# Altium schematic sheet 02_FPGA_IO_Config.SchDoc: Наименование
size 420 x 297 mm; Name: Наименование; ApprovedBy: Сергеева А.А.; CheckedBy: Рогозин А.А.; Author: Кузнецов М.Д.; CompanyName: МГТУ им. Баумана; DocumentNumber: 3; SheetNumber: 2; SheetTotal: 6; PageSetup: Record=PageOptions|CenterHorizontal=True|CenterVertical=True|PrintScale=0.94|XCorrection=1.00|YCorrection=1.00|PrintKind=1|BorderSize=5000000|LeftOffset=0|BottomOffset=0|Orientation=1|PaperLength=1000|PaperWidth=1000|Scale=100|PaperSource=7|PrintQuality=-4|MediaType=1|DitherType=10|PaperKind=A4|PrintScaleMode=1; DecimalNumber: МГТУ.468784.001; HeadOfSector: Нач. сектора; MainDevice: Перв.примен.; Name1: Плата расширения; n_kontr: Н. Контр; t_kontr: Т. Контр; lit_A: О; Name2: для отладочного модуля; DocumentName: Sheet1.SCHDOC
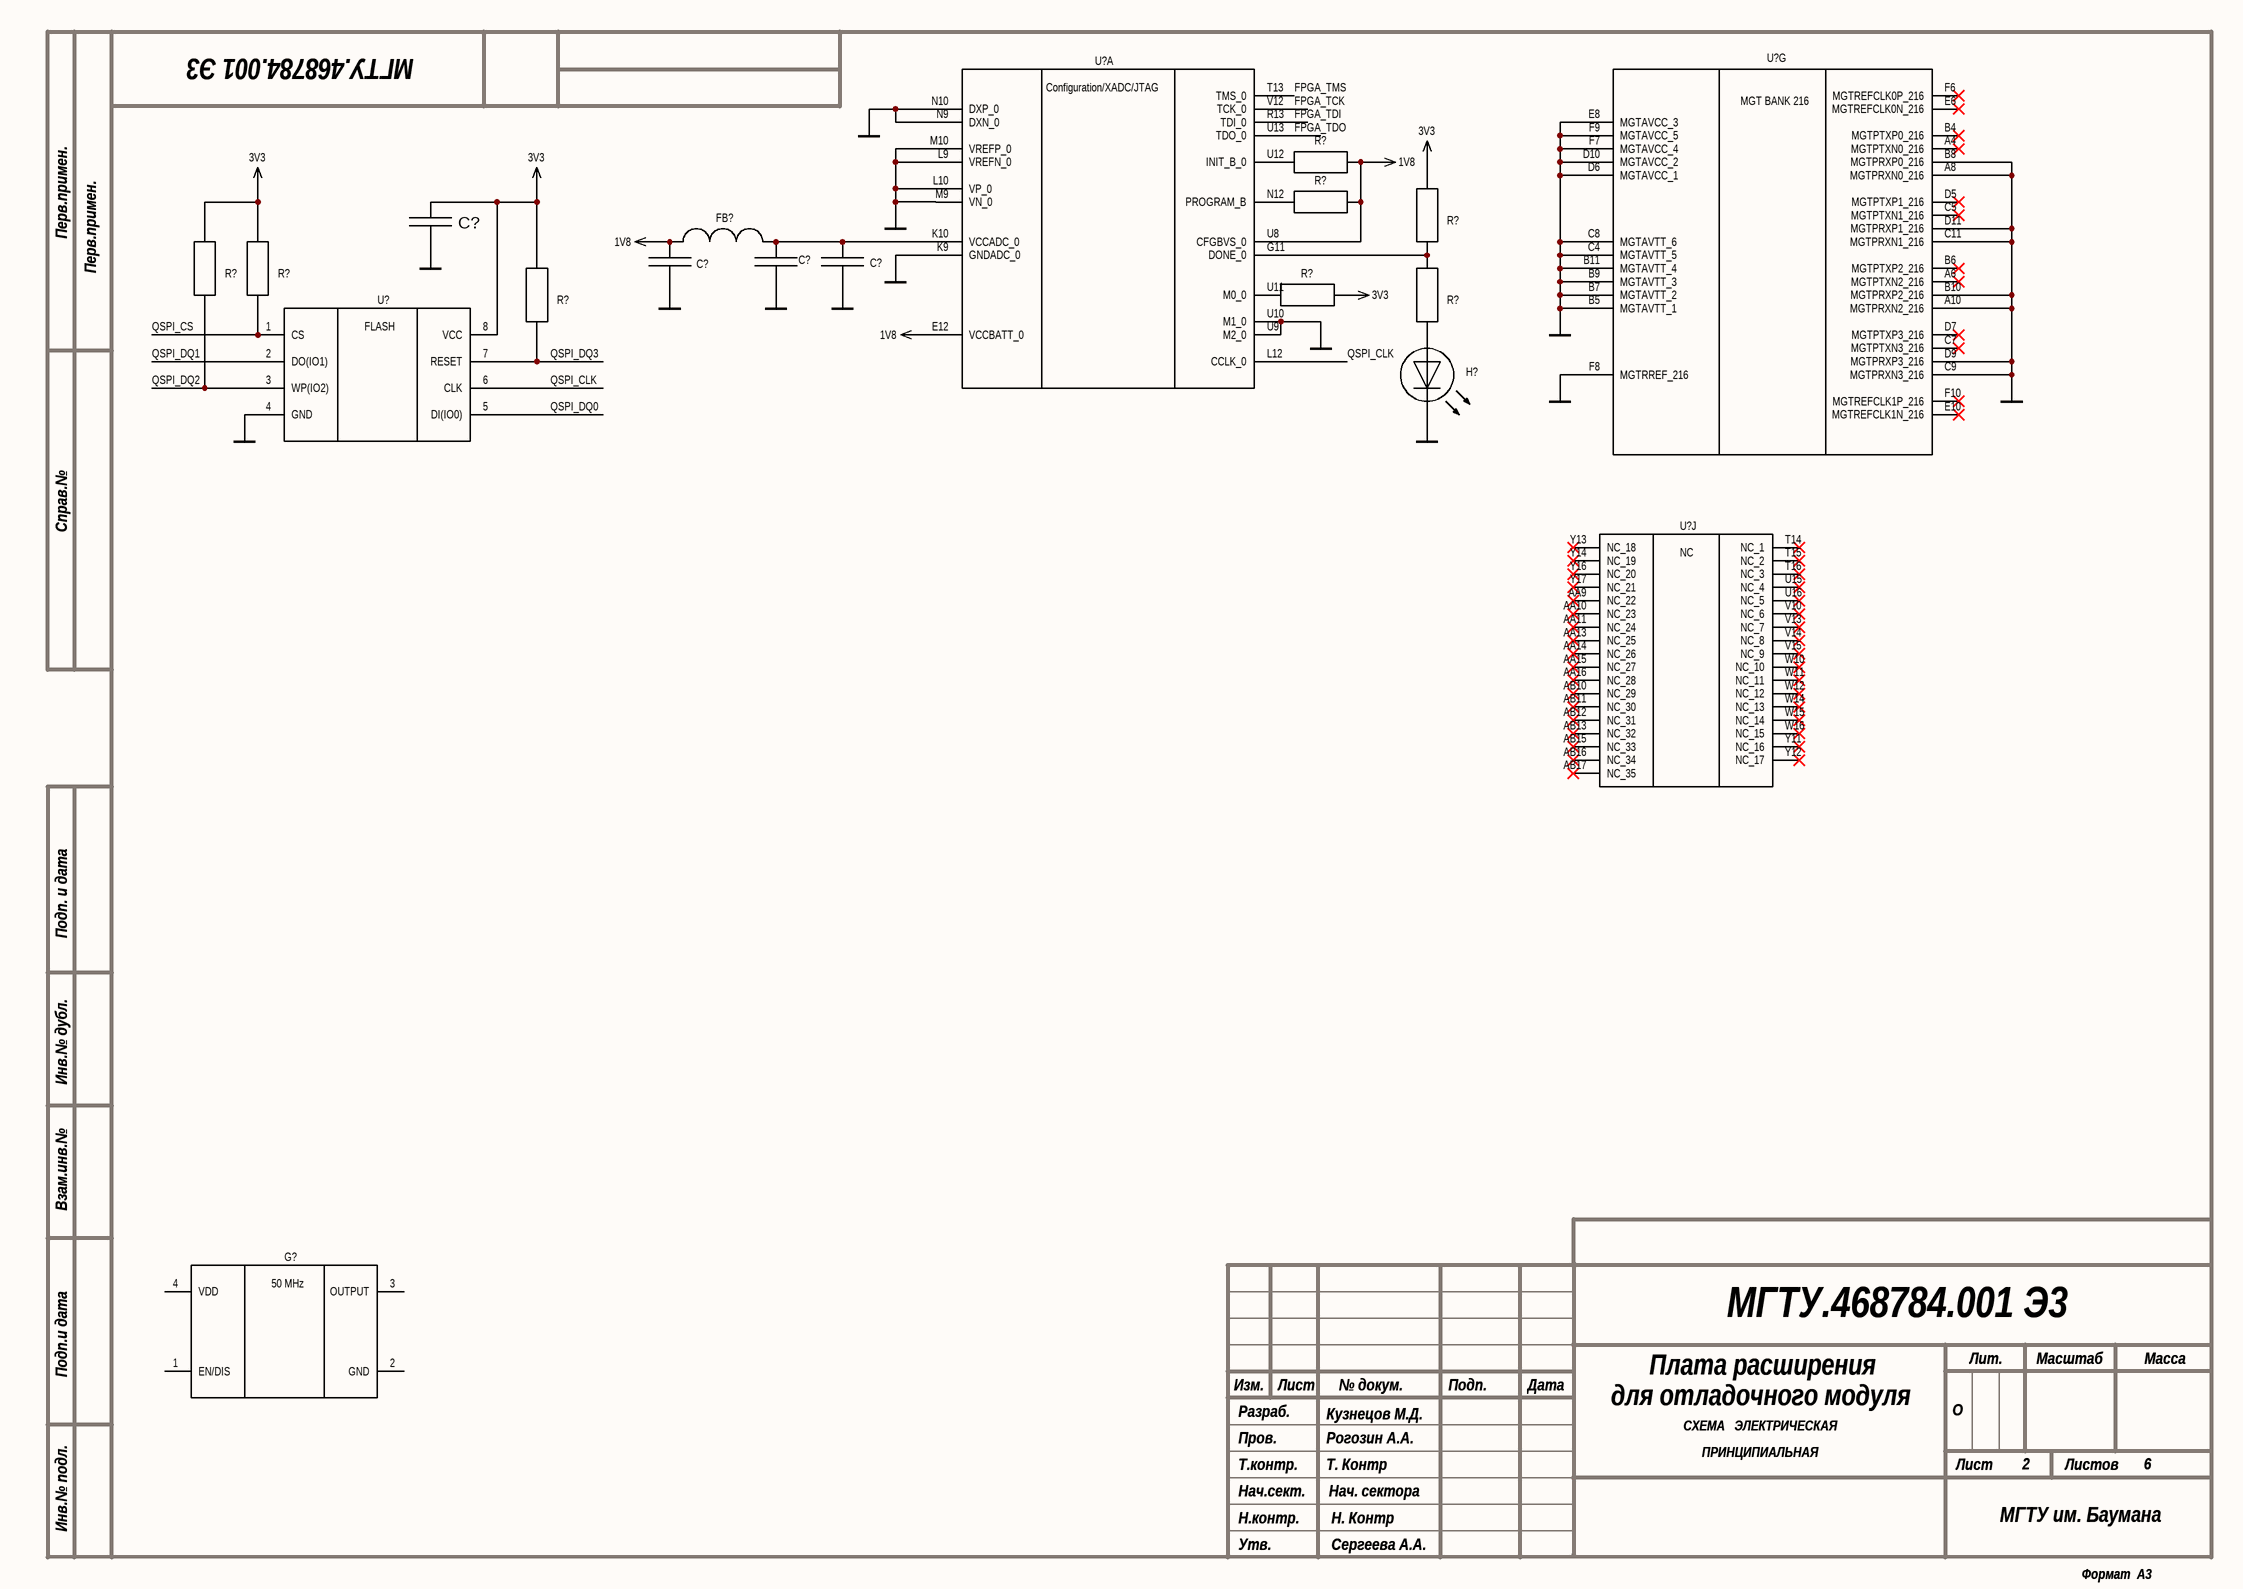
[diagram p0: 02_FPGA_IO_Config.SchDoc]

## Parts
(Parts that share a designator on the sheet are numbered #1, #2 ... from top to bottom, then left to right.)
C?#1  C  [C_0603]  (value not drawn)
C?#2  C  [C_1206]  (value not drawn)
C?#3  C  [C_0805]  (value not drawn)
C?#4  C  [C_0603]  (value not drawn)
FB?  BLM18SG121TN1D  [FP-BLM18-0_15-t0_5-d1_2-IPC_B]  (value not drawn)
G?  ASV-50.000MHZ-LRS-T  [ASV25000MHZEJT]  (value not drawn)
H?  LED  [PLCC2]  (value not drawn)
R?#1  R  [R_1206]  (value not drawn)
R?#2  R  [R_1206]  (value not drawn)
R?#3  R  [R_1206]  (value not drawn)
R?#4  R  [R_1206]  (value not drawn)
R?#5  R  [R_1206]  (value not drawn)
R?#6  R  [R_0603]  (value not drawn)
R?#7  R  [R_0603]  (value not drawn)
R?#8  R  [R_0603]  (value not drawn)
U?#1  XC7A50T-2FGG484I  [BGA484C100P22X22_2300X2300X260]  (value not drawn)  (part A of 10)
U?#2  XC7A50T-2FGG484I  [BGA484C100P22X22_2300X2300X260]  (value not drawn)  (part G of 10)
U?#3  W25Q128JVSIQ  [SOIC127P790X216-8N]  (value not drawn)
U?#4  XC7A50T-2FGG484I  [BGA484C100P22X22_2300X2300X260]  (value not drawn)  (part J of 10)

## Nets
1V8: C?#3.2 FB?.1 R?#1.2 R?#2.2 U?#1.E12(VCCBATT_0) U?#1.U8(CFGBVS_0)
3V3: C?#1.2 R?#3.1 R?#4.1 R?#5.1 R?#6.2 R?#7.2 U?#3.8(VCC)
GND: C?#1.1 C?#2.2 C?#3.1 C?#4.1 H?.2(C) U?#1.K9(GNDADC_0) U?#1.L9(VREFN_0) U?#1.L10(VP_0) U?#1.M9(VN_0) U?#1.M10(VREFP_0) U?#1.N9(DXN_0) U?#1.N10(DXP_0) U?#1.U9(M2_0) U?#1.U10(M1_0) U?#2.A8(MGTPRXN0_216) U?#2.A10(MGTPRXN2_216) U?#2.B5(MGTAVTT_1) U?#2.B7(MGTAVTT_2) U?#2.B8(MGTPRXP0_216) U?#2.B9(MGTAVTT_3) U?#2.B10(MGTPRXP2_216) U?#2.B11(MGTAVTT_4) U?#2.C4(MGTAVTT_5) U?#2.C8(MGTAVTT_6) U?#2.C9(MGTPRXN3_216) U?#2.C11(MGTPRXN1_216) U?#2.D6(MGTAVCC_1) U?#2.D9(MGTPRXP3_216) U?#2.D10(MGTAVCC_2) U?#2.D11(MGTPRXP1_216) U?#2.E8(MGTAVCC_3) U?#2.F7(MGTAVCC_4) U?#2.F8(MGTRREF_216) U?#2.F9(MGTAVCC_5) U?#3.4(GND)
FPGA_TCK: U?#1.V12(TCK_0)
FPGA_TDI: U?#1.R13(TDI_0)
FPGA_TDO: U?#1.U13(TDO_0)
FPGA_TMS: U?#1.T13(TMS_0)
QSPI_CLK: U?#1.L12(CCLK_0) U?#3.6(CLK)
QSPI_CS: R?#4.2 U?#3.1(CS)
QSPI_DQ0: U?#3.5(DI(IO0))
QSPI_DQ1: U?#3.2(DO(IO1))
QSPI_DQ2: R?#3.2 U?#3.3(WP(IO2))
QSPI_DQ3: R?#5.2 U?#3.7(RESET)
NetC?#2_1: C?#2.1 C?#4.2 FB?.2 U?#1.K10(VCCADC_0)
NetH?_1: H?.1(A) R?#8.1
NetR?#1_1: R?#1.1 U?#1.U12(INIT_B_0)
NetR?#2_1: R?#2.1 U?#1.N12(PROGRAM_B)
NetR?#6_1: R?#6.1 R?#8.2 U?#1.G11(DONE_0)
NetR?#7_1: R?#7.1 U?#1.U11(M0_0)

Not connected (* = marked no-connect by the designer): G? 1(EN/DIS) 2(GND) 3(OUTPUT) 4(VDD); U?#2 A4(MGTPTXN0_216)* A6(MGTPTXN2_216)* B4(MGTPTXP0_216)* B6(MGTPTXP2_216)* C5(MGTPTXN1_216)* C7(MGTPTXN3_216)* D5(MGTPTXP1_216)* D7(MGTPTXP3_216)* E6(MGTREFCLK0N_216)* E10(MGTREFCLK1N_216)* F6(MGTREFCLK0P_216)* F10(MGTREFCLK1P_216)*; U?#4 AA9(NC_22)* AA10(NC_23)* AA11(NC_24)* AA13(NC_25)* AA14(NC_26)* AA15(NC_27)* AA16(NC_28)* AB10(NC_29)* AB11(NC_30)* AB12(NC_31)* AB13(NC_32)* AB15(NC_33)* AB16(NC_34)* AB17(NC_35)* T14(NC_1)* T15(NC_2)* T16(NC_3)* U15(NC_4)* U16(NC_5)* V10(NC_6)* V13(NC_7)* V14(NC_8)* V15(NC_9)* W10(NC_10)* W11(NC_11)* W12(NC_12)* W14(NC_13)* W15(NC_14)* W16(NC_15)* Y11(NC_16)* Y12(NC_17)* Y13(NC_18)* Y14(NC_19)* Y16(NC_20)* Y17(NC_21)*

## Notes on the sheet
- Перв.примен.
- Справ.№
- Подп. и дата
- Инв.№ дубл.
- Взам.инв.№
- Подп.и дата
- Разраб.
- Изм.
- Лист
- № докум.
- Подп.
- Дата
- Лит.
- Масштаб
- Масса
- Т.контр.
- Пров.
- СХЕМА   ЭЛЕКТРИЧЕСКАЯ
- ПРИНЦИПИАЛЬНАЯ
- Листов
- Инв.№ подл.
- Утв.
- Н.контр.
- Нач.сект.
- Формат  A3
- (in symbol ASV-50.000MHZ-LRS-T) 50 MHz
- (in symbol W25Q128JVSIQ) FLASH
- (in symbol XC7A50T-2FGG484I, part A) Configuration/XADC/JTAG
- (in symbol XC7A50T-2FGG484I, part G) MGT BANK 216
- (in symbol XC7A50T-2FGG484I, part J) NC

## Library data of the parts
C?#1 C?#4 = Конденсатор GRM188R71C104K (0.10 мкФ +-10% X7R 16В): Capacitance: 0u1; Tolerance: ±10%; Dielectric Type: X7R; Maximum Voltage: 16V; Part Number: Конденсатор GRM188R71C104K (0.10 мкФ +-10% X7R 16В); HelpURL: http://search.murata.co.jp/Ceramy/image/img/A01X/G101/ENG/GRM188R71C104KA01-01.pdf
C?#2 = Конденсатор GRM31CR71H475K (4.7 мкФ +-10% X7R 50В): Capacitance: 4u7; Tolerance: ±10%; Dielectric Type: X7R; Maximum Voltage: 50V; Part Number: Конденсатор GRM31CR71H475K (4.7 мкФ +-10% X7R 50В); HelpURL: http://search.murata.co.jp/Ceramy/image/img/A01X/G101/ENG/GRM31CR71H475KA12-01.pdf
C?#3 = Конденсатор GRM21BR71C105K (1.0 мкФ +-10% X7R 16В): Capacitance: 1u; Tolerance: ±10%; Dielectric Type: X7R; Maximum Voltage: 16V; Part Number: Конденсатор GRM21BR71C105K (1.0 мкФ +-10% X7R 16В); HelpURL: http://search.murata.co.jp/Ceramy/image/img/A01X/G101/ENG/GRM21BR71C105KA01-01.pdf
FB? = CMP-0686-00602-4: Chip Ferrite Bead, 0603, 120Ω @ 100MHz, 25%, 0.025Ω, 3A; DC Resistance (DCR): 25mR; Shielding: Unshielded; Material: Steel; Number of Circuits: 1; Impedance: 120R; Tolerance: 25%; REACH SVHC: No SVHC; Case/Package: 0603; Max DC Current: 3A; Core Material: Ferrite; Case Code (Metric): 1608; Frequency: 100MHz; Package Quantity: 1; Height: 0.8mm; Lead Free: Lead Free; Test Frequency: 100MHz; RoHS Compliant: Yes; DC Resistance-Max: 25mR; Min Operating Temperature: -55°C; Width: 0.8mm; Termination: SMD/SMT; Length: 1.6mm; Max Current Rating: 3A; Number of Lines: 1; Series: BLM18S; Number of Pins: 2; Packaging: Tape and Reel; Current Rating: 3A; Depth: 0.8mm; Case Code (Imperial): 0603; Max Operating Temperature: 125°C
G? = ASV-50.000MHZ-LRS-T: Crystal or Oscillator; Manufacturer_Name: ABRACON; Datasheet Link: https://abracon.com/Oscillators/ASV.pdf; Height: 1.8mm; Manufacturer_Part_Number: ASV-50.000MHZ-LRS-T; Mouser Part Number: 815-ASV50000MHZLRST; Mouser Price/Stock: https://www.mouser.co.uk/ProductDetail/ABRACON/ASV-50.000MHZ-LRS-T?qs=vmHwEFxEFR%252BcE99Zr2GZkQ%3D%3D
H? = Светодиод CLM1B-RKW: Part Number: Светодиод CLM1B-RKW; HelpURL: http://www.cree.com/~/media/Files/Cree/LED-Components-and-Modules/HB/Data-Sheets/CLM1BRKWAKW1084.pdf; Color: Red
R?#1-R?#5 = Резистор RC1206JR-074K7L (4.7 кОм +-5%): Resistance: 4k7; Tolerance: ±5%; Power: 0.25 W; Maximum Working Voltage: 200V; Maximum Overload Voltage: 400V; Part Number: Резистор RC1206JR-074K7L (4.7 кОм +-5%); HelpURL: http://www.yageo.ru/pdf/RC1206.pdf
R?#6 R?#8 = Резистор RC0603JR-07240RL (240 Ом +-5%): Resistance: 240; Tolerance: ±5%; Power: 0.1 W; Maximum Working Voltage: 50V; Maximum Overload Voltage: 100V; Part Number: Резистор RC0603JR-07240RL (240 Ом +-5%); HelpURL: http://www.yageo.ru/pdf/RC0603.pdf
R?#7 = Резистор RC0603JR-0711KL (11 кОм +-5%): Resistance: 11k; Tolerance: ±5%; Power: 0.1 W; Maximum Working Voltage: 50V; Maximum Overload Voltage: 100V; Part Number: Резистор RC0603JR-0711KL (11 кОм +-5%); HelpURL: http://www.yageo.ru/pdf/RC0603.pdf
U?#1 U?#2 U?#4 = XC7A50T-2FGG484I: FPGA - Field Programmable Gate Array XC7A50T-2FGG484I; Manufacturer_Name: AMD; Geometry.Height: 2.6mm; Manufacturer_Part_Number: XC7A50T-2FGG484I; Mouser Part Number: 217-XC7A50T-2FGG484I; Mouser Price/Stock: https://www.mouser.co.uk/ProductDetail/Xilinx/XC7A50T-2FGG484I?qs=rrS6PyfT74djoRso%252BOe%2F9Q%3D%3D; Arrow Part Number: *; Arrow Price/Stock: *; Datasheet Link: https://www.xilinx.com/support/documentation/data_sheets/ds181_Artix_7_Data_Sheet.pdf
U?#3 = W25Q128JVSIQ: FLASH - NOR Memory IC 128Mb (16M x 8) SPI - Quad I/O, QPI, DTR 133 MHz 8-SOIC; MF: Winbond Electronics; SnapEDA_Link: https://www.snapeda.com/parts/W25Q128JVSIQ/Winbond/view-part/?ref=snap; Package: SOIC-8 Winbond Electronics; Value: *; MP: W25Q128JVSIQ; Check_prices: https://www.snapeda.com/parts/W25Q128JVSIQ/Winbond/view-part/?ref=eda